# Altium schematic sheet Top_Level.SchDoc: MCU - Top
size 431 x 279 mm; DrawnBy: K. Heyer; Organization: ORGANIZATION; Address1: 207; Address2: 13399 104 Ave; Address3: Surrey BC, V3T 0C9; Address4: Canada; Revision: V0.0.1; SheetNumber: 1; SheetTotal: 5; Project: Laser Diode; ENG_APP_DATE: --/--/--; DSN_APP_DATE: --/--/--; CHK_APP_DATE: --/--/--
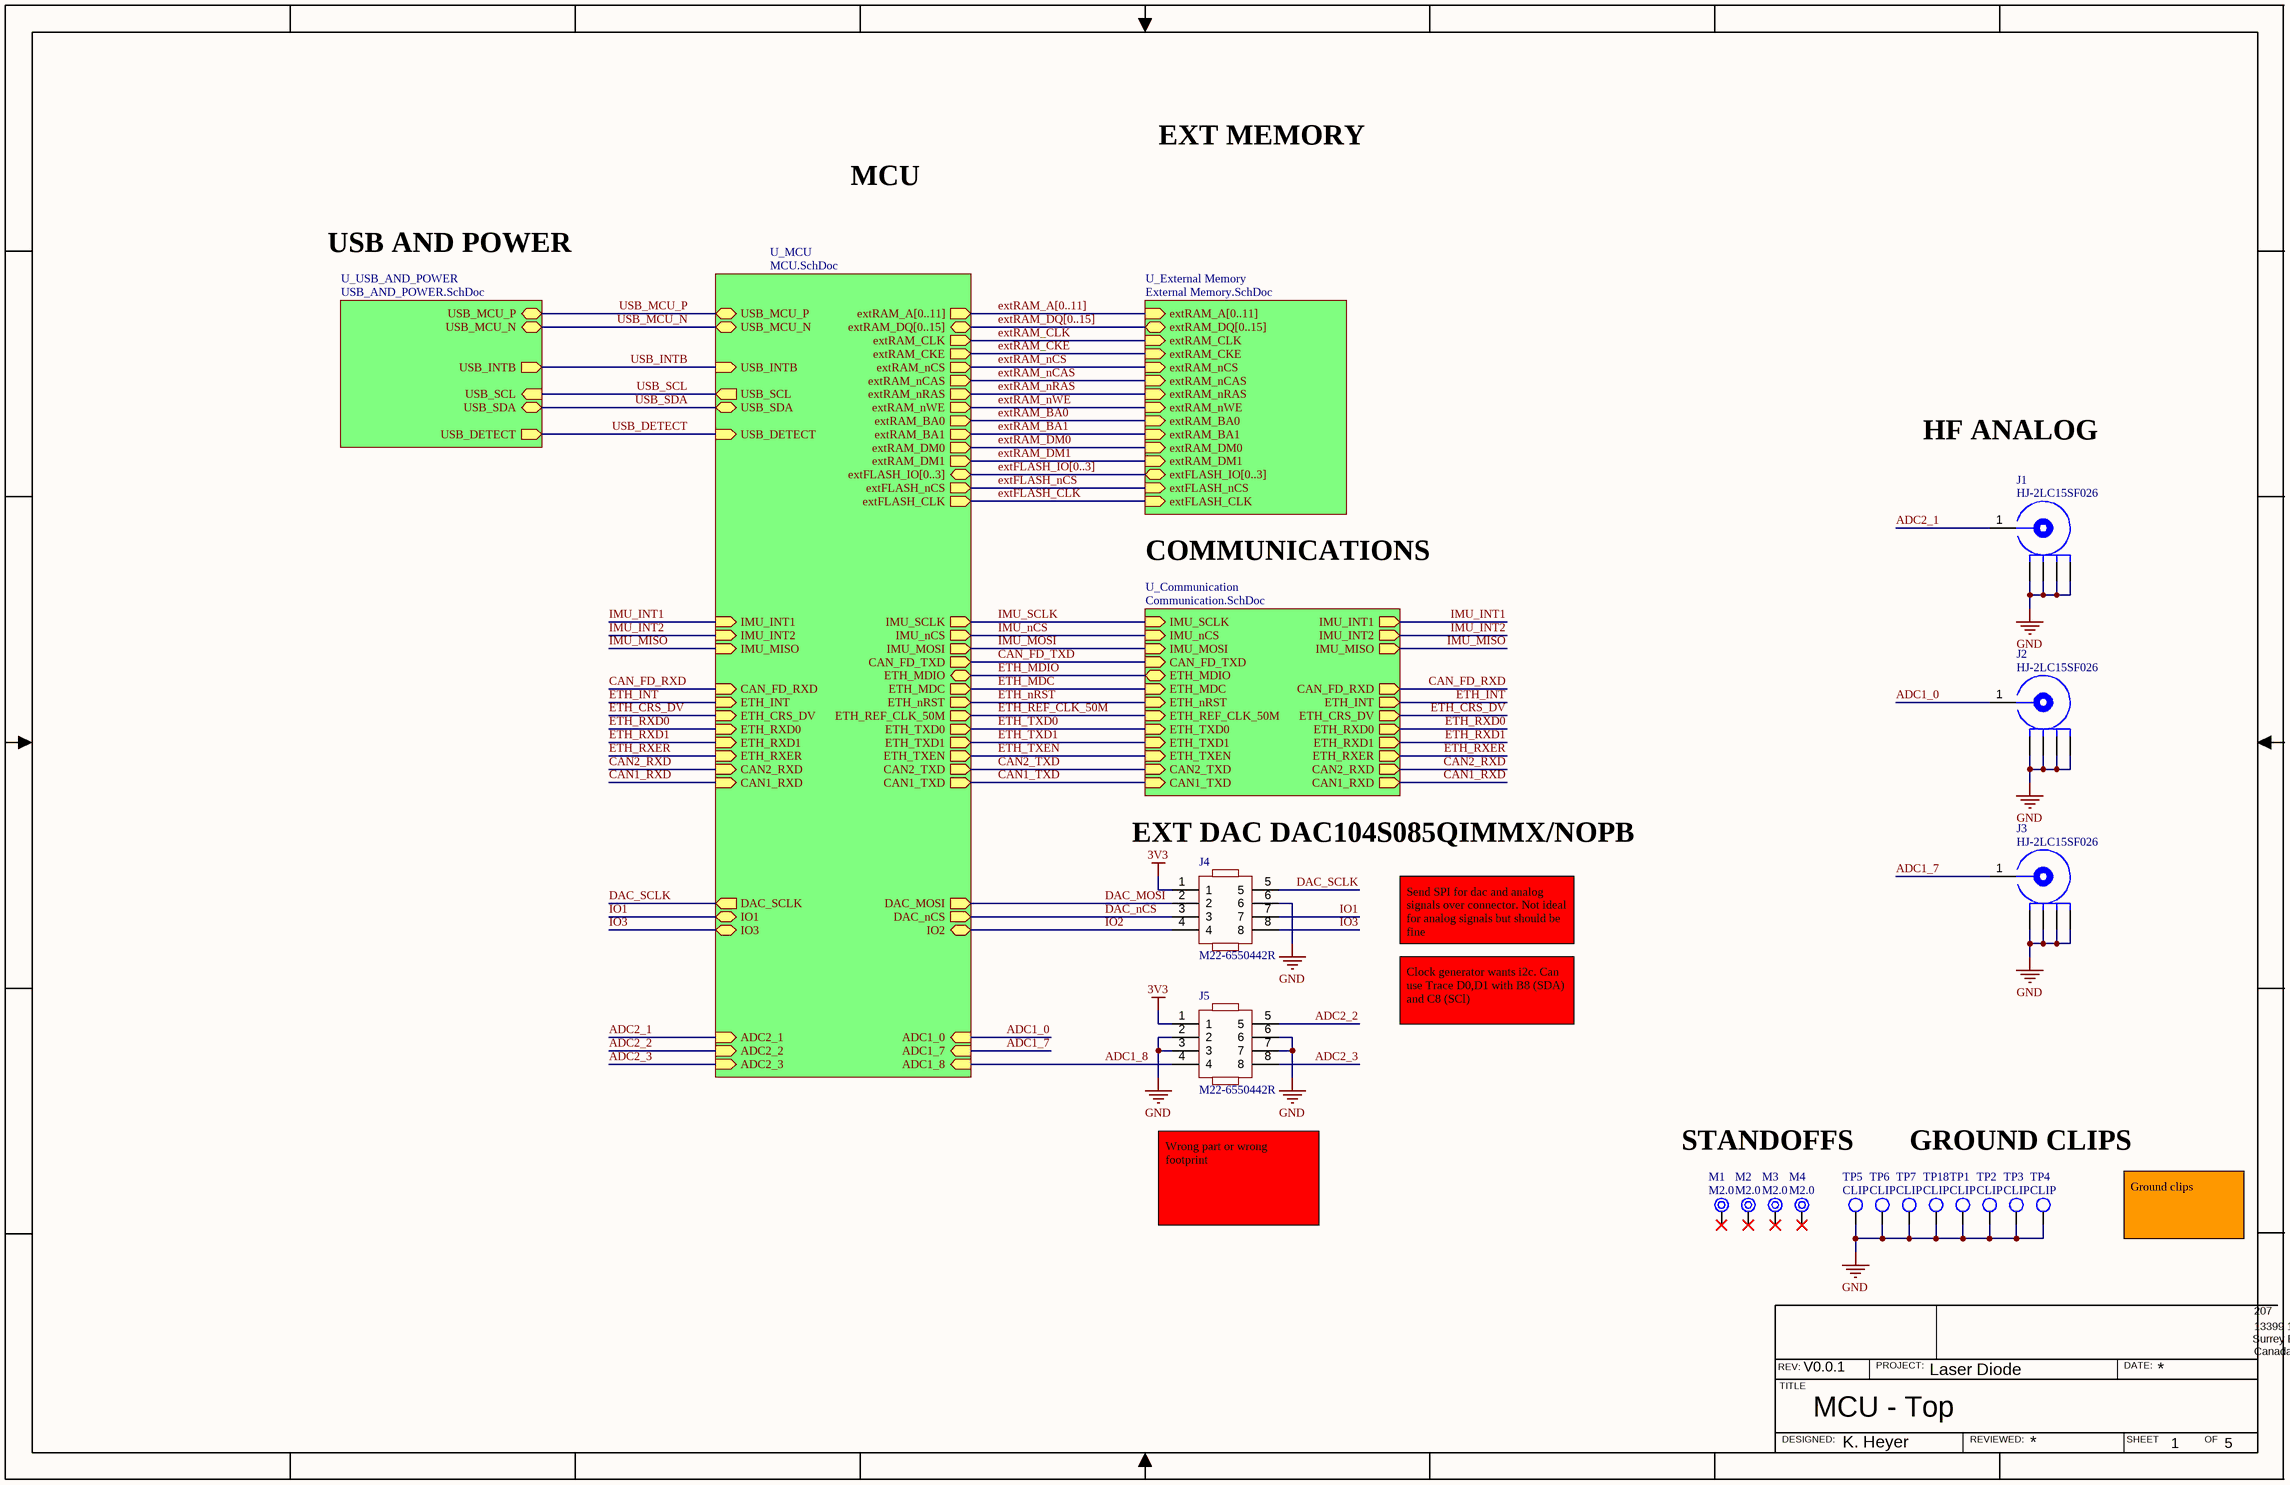
[diagram p0: Top_Level.SchDoc]

## Parts
J1  HJ-2LC15SF026  [SMA TH RA BORE]
J2  HJ-2LC15SF026  [SMA TH RA BORE]
J3  HJ-2LC15SF026  [SMA TH RA BORE]
J4  M22-6550442R  [CONN HDR 08 FEMALE RA 2ROW]
J5  M22-6550442R  [CONN HDR 08 FEMALE RA 2ROW]
M1  M2.0  [MECH M2.0 UNPLATED]  (no BOM)
M2  M2.0  [MECH M2.0 UNPLATED]  (no BOM)
M3  M2.0  [MECH M2.0 UNPLATED]  (no BOM)
M4  M2.0  [MECH M2.0 UNPLATED]  (no BOM)
TP1  CLIP  [TESTPOINT_CLIP_1206]
TP2  CLIP  [TESTPOINT_CLIP_1206]
TP3  CLIP  [TESTPOINT_CLIP_1206]
TP4  CLIP  [TESTPOINT_CLIP_1206]
TP5  CLIP  [TESTPOINT_CLIP_1206]
TP6  CLIP  [TESTPOINT_CLIP_1206]
TP7  CLIP  [TESTPOINT_CLIP_1206]
TP18  CLIP  [TESTPOINT_CLIP_1206]

## Sub-sheets
U_Communication = Communication.SchDoc: IMU_INT1 (out), IMU_INT2 (out), IMU_SCLK (in), IMU_nCS (in), IMU_MISO (out), IMU_MOSI (in), CAN_FD_TXD (in), CAN_FD_RXD (out), ETH_INT (out), ETH_MDIO (bidir), ETH_MDC (in), ETH_nRST (in), ETH_CRS_DV (out), ETH_REF_CLK_50M (in), ETH_RXD0 (out), ETH_RXD1 (out), ETH_TXD0 (in), ETH_TXD1 (in), ETH_TXEN (in), ETH_RXER (out), CAN2_TXD (in), CAN2_RXD (out), CAN1_TXD (in), CAN1_RXD (out)
U_External Memory = External Memory.SchDoc: extRAM_A[0..11] (in), extRAM_DQ[0..15] (bidir), extRAM_CLK (in), extRAM_CKE (in), extRAM_nCS (in), extRAM_nCAS (in), extRAM_nRAS (in), extRAM_nWE (in), extRAM_BA0 (in), extRAM_BA1 (in), extRAM_DM0 (in), extRAM_DM1 (in), extFLASH_IO[0..3] (bidir), extFLASH_nCS (in), extFLASH_CLK (in)
U_MCU = MCU.SchDoc: USB_MCU_P (bidir), USB_MCU_N (bidir), USB_INTB (in), USB_SCL (out), USB_SDA (bidir), extRAM_A[0..11] (out), extRAM_DQ[0..15] (bidir), extRAM_CLK (out), extRAM_CKE (out), extRAM_nCS (out), extRAM_nCAS (out), extRAM_nRAS (out), extRAM_nWE (out), extRAM_BA0 (out), extFLASH_IO[0..3] (bidir), extRAM_BA1 (out), extRAM_DM0 (out), extRAM_DM1 (out), extFLASH_CLK (out), extFLASH_nCS (out), IMU_SCLK (out), IMU_nCS (out), IMU_MOSI (out), CAN_FD_TXD (out), ETH_MDIO (bidir), ETH_MDC (out), ETH_nRST (out), ETH_REF_CLK_50M (out), ETH_TXD0 (out), ETH_TXD1 (out), ETH_TXEN (out), CAN2_TXD (out), CAN1_TXD (out), IMU_INT1 (in), IMU_INT2 (in), IMU_MISO (in), CAN_FD_RXD (in), ETH_INT (in), ETH_CRS_DV (in), ETH_RXD0 (in), ETH_RXD1 (in), ETH_RXER (in), CAN2_RXD (in), CAN1_RXD (in), DAC_MOSI (out), DAC_nCS (out), IO2 (bidir), ADC2_3 (in), ADC1_7 (in), ADC1_8 (in), ADC2_2 (in), ADC1_0 (in), ADC2_1 (in), IO3 (bidir), IO1 (bidir), DAC_SCLK (out), USB_DETECT (in)
U_USB_AND_POWER = USB_AND_POWER.SchDoc: USB_MCU_P (bidir), USB_MCU_N (bidir), USB_INTB (out), USB_SCL (in), USB_SDA (bidir), USB_DETECT (out)

## Nets
3V3: J4.1 J5.1
GND: J1.0 J2.0 J3.0 J4.6 J5.2 J5.3 J5.6 J5.7 TP1.1 TP2.1 TP3.1 TP4.1 TP5.1 TP6.1 TP7.1 TP18.1
ADC1_0: J2.1 ; sheet U_MCU/ADC1_0
ADC1_7: J3.1 ; sheet U_MCU/ADC1_7
ADC1_8: J5.4 ; sheet U_MCU/ADC1_8
ADC2_1: J1.1 ; sheet U_MCU/ADC2_1
ADC2_2: J5.5 ; sheet U_MCU/ADC2_2
ADC2_3: J5.8 ; sheet U_MCU/ADC2_3
CAN1_RXD: sheet U_MCU/CAN1_RXD, sheet U_Communication/CAN1_RXD
CAN1_TXD: sheet U_MCU/CAN1_TXD, sheet U_Communication/CAN1_TXD
CAN2_RXD: sheet U_MCU/CAN2_RXD, sheet U_Communication/CAN2_RXD
CAN2_TXD: sheet U_MCU/CAN2_TXD, sheet U_Communication/CAN2_TXD
CAN_FD_RXD: sheet U_MCU/CAN_FD_RXD, sheet U_Communication/CAN_FD_RXD
CAN_FD_TXD: sheet U_MCU/CAN_FD_TXD, sheet U_Communication/CAN_FD_TXD
DAC_MOSI: J4.2 ; sheet U_MCU/DAC_MOSI
DAC_nCS: J4.3 ; sheet U_MCU/DAC_nCS
DAC_SCLK: J4.5 ; sheet U_MCU/DAC_SCLK
ETH_CRS_DV: sheet U_MCU/ETH_CRS_DV, sheet U_Communication/ETH_CRS_DV
ETH_INT: sheet U_MCU/ETH_INT, sheet U_Communication/ETH_INT
ETH_MDC: sheet U_MCU/ETH_MDC, sheet U_Communication/ETH_MDC
ETH_MDIO: sheet U_MCU/ETH_MDIO, sheet U_Communication/ETH_MDIO
ETH_nRST: sheet U_MCU/ETH_nRST, sheet U_Communication/ETH_nRST
ETH_REF_CLK_50M: sheet U_MCU/ETH_REF_CLK_50M, sheet U_Communication/ETH_REF_CLK_50M
ETH_RXD0: sheet U_MCU/ETH_RXD0, sheet U_Communication/ETH_RXD0
ETH_RXD1: sheet U_MCU/ETH_RXD1, sheet U_Communication/ETH_RXD1
ETH_RXER: sheet U_MCU/ETH_RXER, sheet U_Communication/ETH_RXER
ETH_TXD0: sheet U_MCU/ETH_TXD0, sheet U_Communication/ETH_TXD0
ETH_TXD1: sheet U_MCU/ETH_TXD1, sheet U_Communication/ETH_TXD1
ETH_TXEN: sheet U_MCU/ETH_TXEN, sheet U_Communication/ETH_TXEN
extFLASH_CLK: sheet U_External Memory/extFLASH_CLK, sheet U_MCU/extFLASH_CLK
extFLASH_nCS: sheet U_External Memory/extFLASH_nCS, sheet U_MCU/extFLASH_nCS
extRAM_BA0: sheet U_External Memory/extRAM_BA0, sheet U_MCU/extRAM_BA0
extRAM_BA1: sheet U_External Memory/extRAM_BA1, sheet U_MCU/extRAM_BA1
extRAM_CKE: sheet U_External Memory/extRAM_CKE, sheet U_MCU/extRAM_CKE
extRAM_CLK: sheet U_External Memory/extRAM_CLK, sheet U_MCU/extRAM_CLK
extRAM_DM0: sheet U_External Memory/extRAM_DM0, sheet U_MCU/extRAM_DM0
extRAM_DM1: sheet U_External Memory/extRAM_DM1, sheet U_MCU/extRAM_DM1
extRAM_nCAS: sheet U_External Memory/extRAM_nCAS, sheet U_MCU/extRAM_nCAS
extRAM_nCS: sheet U_External Memory/extRAM_nCS, sheet U_MCU/extRAM_nCS
extRAM_nRAS: sheet U_External Memory/extRAM_nRAS, sheet U_MCU/extRAM_nRAS
extRAM_nWE: sheet U_External Memory/extRAM_nWE, sheet U_MCU/extRAM_nWE
IMU_INT1: sheet U_MCU/IMU_INT1, sheet U_Communication/IMU_INT1
IMU_INT2: sheet U_MCU/IMU_INT2, sheet U_Communication/IMU_INT2
IMU_MISO: sheet U_MCU/IMU_MISO, sheet U_Communication/IMU_MISO
IMU_MOSI: sheet U_MCU/IMU_MOSI, sheet U_Communication/IMU_MOSI
IMU_nCS: sheet U_MCU/IMU_nCS, sheet U_Communication/IMU_nCS
IMU_SCLK: sheet U_MCU/IMU_SCLK, sheet U_Communication/IMU_SCLK
IO1: J4.7 ; sheet U_MCU/IO1
IO2: J4.4 ; sheet U_MCU/IO2
IO3: J4.8 ; sheet U_MCU/IO3
USB_DETECT: sheet U_MCU/USB_DETECT, sheet U_USB_AND_POWER/USB_DETECT
USB_INTB: sheet U_MCU/USB_INTB, sheet U_USB_AND_POWER/USB_INTB
USB_MCU_N: sheet U_MCU/USB_MCU_N, sheet U_USB_AND_POWER/USB_MCU_N
USB_MCU_P: sheet U_MCU/USB_MCU_P, sheet U_USB_AND_POWER/USB_MCU_P
USB_SCL: sheet U_MCU/USB_SCL, sheet U_USB_AND_POWER/USB_SCL
USB_SDA: sheet U_MCU/USB_SDA, sheet U_USB_AND_POWER/USB_SDA

Not connected (* = marked no-connect by the designer): M1 1*; M2 1*; M3 1*; M4 1*

## Buses and harness runs
bus extFLASH_IO[0..3] = sheet U_External Memory/extFLASH_IO[0..3] = sheet U_MCU/extFLASH_IO[0..3]
bus extRAM_A[0..11] = sheet U_External Memory/extRAM_A[0..11] = sheet U_MCU/extRAM_A[0..11]
bus extRAM_DQ[0..15] = sheet U_External Memory/extRAM_DQ[0..15] = sheet U_MCU/extRAM_DQ[0..15]

## Notes on the sheet
- EXT MEMORY
- MCU
- USB AND POWER
- HF ANALOG
- COMMUNICATIONS
- (near J4) EXT DAC DAC104S085QIMMX/NOPB
- Send SPI for dac and analog signals over connector. Not ideal for analog signals but should be fine
- Clock generator wants i2c. Can use Trace D0,D1 with B8 (SDA) and C8 (SCl)
- STANDOFFS
- GROUND CLIPS
- Wrong part or wrong footprint
- Ground clips
- REV:
- PROJECT:
- DATE:
- TITLE
- SHEET
- OF
- DESIGNED:
- REVIEWED:

## Library data of the parts
J1-J3 = CON SMA BORE SMD RA HJ-2LC15SF026
J4 J5 = CONN HDR 08 FEMALE RA 2 ROW: Conn Socket Strip RCP 8 POS 2mm Solder RA SMD T/R; Manufacturer: Harwin; Connector Type: Receptacle,Forked; Number of Positions: 8; Current Rating: 2A; Supplier 1: Newark; Manufacturer Part Number: M22-6550442R; RoHS: Yes; Category: Connectors; Stock 1: 750; Pricing 1: 1=1.17000, 100=0.91900, 250=0.84000, 500=0.76600, 1000=0.71200 (USD); Mount: Surface Mount; Contact Plating: Gold; Contact Material: Bronze; Insulation Color: Black; Insulation Material: Polymer; Contact Shape: Square; Min Operating Temperature: -40°C; Max Operating Temperature: 105°C; Fastening Type: Push,Pull; Packaging: Cut Tape; Number of Rows: 2; Termination: Solder; Flammability Rating: UL94 V-0; RoHS Compliant: Yes; ComponentLink1URL: https://cdn.harwin.com/pdfs/M22-655R.pdf?src-supplier=Digi-Key; ComponentLink1Description: https://cdn.harwin.com/pdfs/M22-655R.pdf?src-supplier=Digi-Key; Supplier Part Number 1: 45AJ6425
M1-M4 = MECH M2.0 UNPLATED
TP1-TP7 TP18 = TP CLIP 1206 RCWCTE: Current Sense Resistors - SMD CHIP CHECKER HT=2.0 1206; Manufacturer: KOA Speer; Manufacturer Part Number: RCWCTE; Resistance: 0R; Current Rating: 2A; Supplier 1: Digi-Key; RoHS: Yes; Category: Chip SMD Resistors; Stock 1: 282207; Pricing 1: 1=0.16000, 10=0.13700, 25=0.12120, 50=0.11320, 100=0.10500, 250=0.09292, 500=0.08888, 1000=0.07272 (USD); Mount: Surface Mount; Case/Package: 1206; Case Code (Imperial): 1206; Case Code (Metric): 3216; Min Operating Temperature: -55°C; Max Operating Temperature: 125°C; Packaging: Tape and Reel; Termination: SMD/SMT; Series: RC; Length: 3.2mm; Width: 1.6mm; Height: 2mm; Depth: 1.6mm; Military Standard: Not; RoHS Compliant: Yes; ComponentLink1URL: https://datasheet.ciiva.com/34302/1876186-34302940.pdf?src-supplier=Jameco; ComponentLink1Description: https://datasheet.ciiva.com/34302/1876186-34302940.pdf?src-supplier=Jameco; ComponentLink2URL: https://datasheet.ciiva.com/5556/rc-5556236.pdf?src-supplier=Mouser; ComponentLink2Description: https://datasheet.ciiva.com/5556/rc-5556236.pdf?src-supplier=Mouser; ComponentLink3URL: https://datasheet.ciiva.com/26821/getdatasheetpartid-110197-26821157.pdf?src-supplier=Verical; ComponentLink3Description: https://datasheet.ciiva.com/26821/getdatasheetpartid-110197-26821157.pdf?src-supplier=Verical; Supplier Part Number 1: 2019-RCWCTECT-ND